# Altium project CSBox.PrjPcb
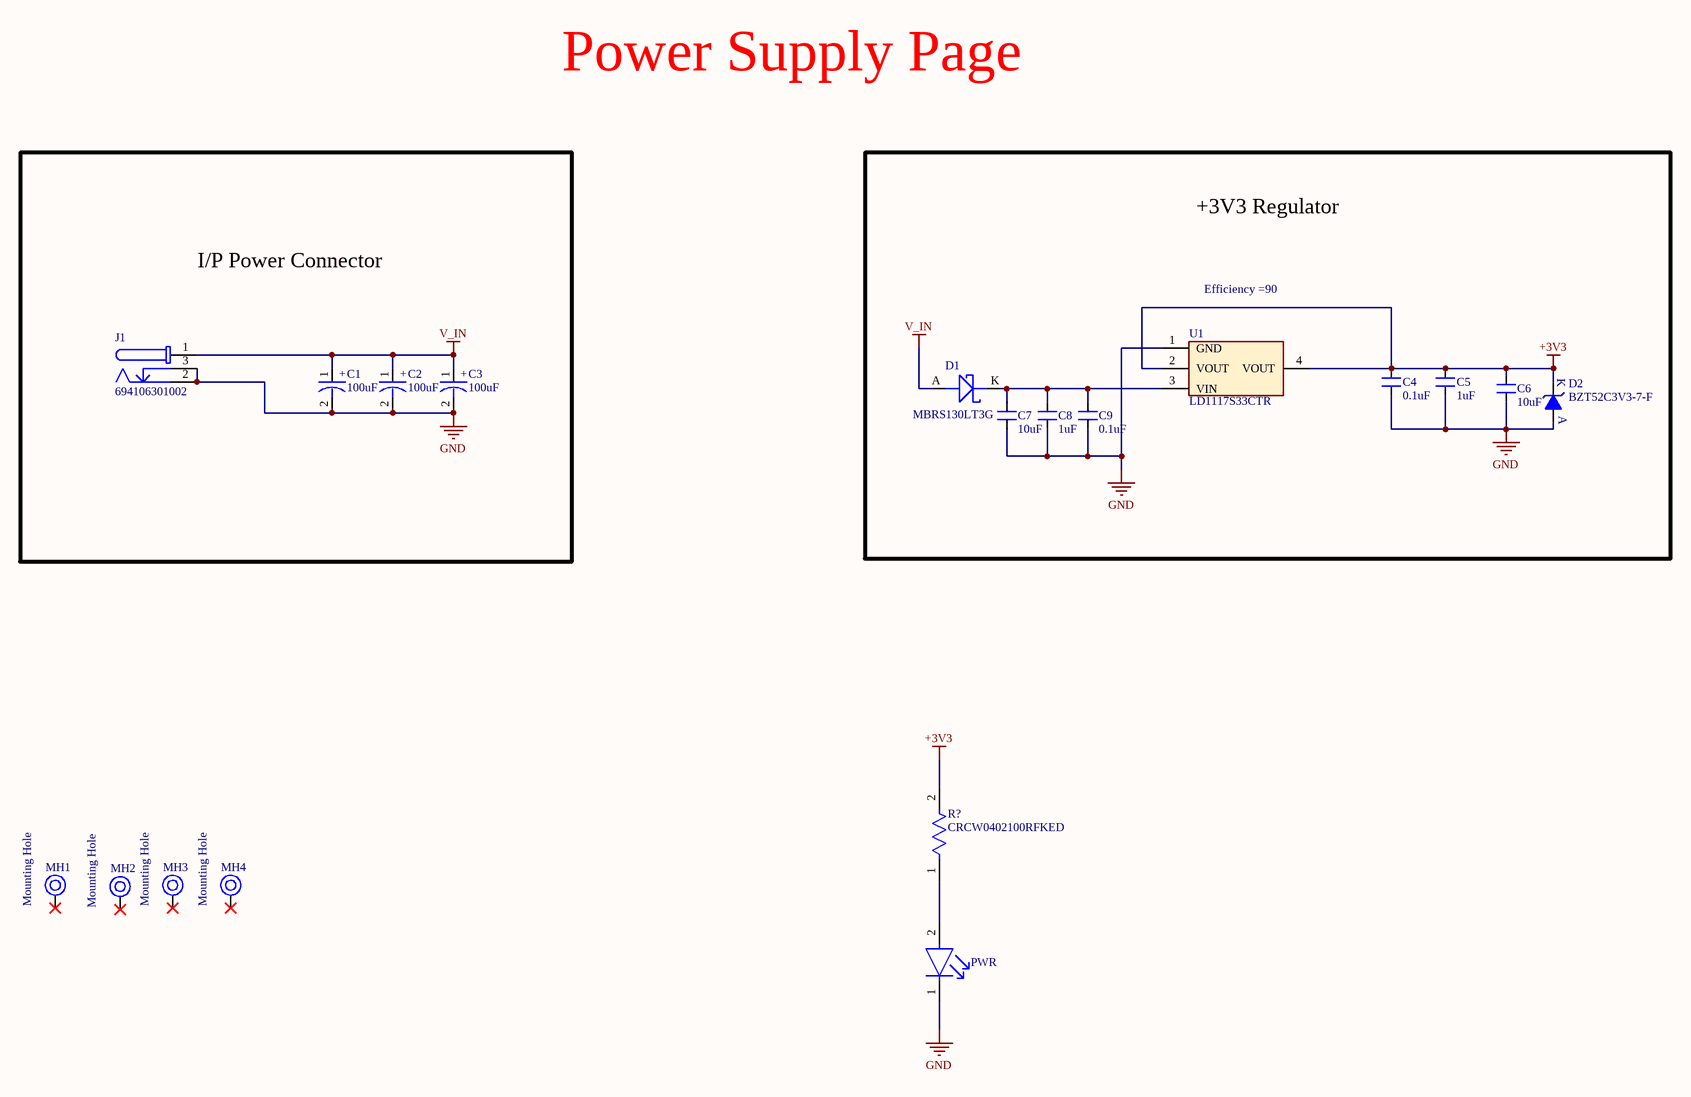
[diagram p0: power supply.SchDoc]
5 sheets, 95 parts. Net scope: global (net labels, ports and power ports of the same name join across sheets).
Board file: CSBox.PcbDoc
Sheets:
  power supply.SchDoc
  MCU.SchDoc
  Ethernet_1.SchDoc
  Ethernet_2.SchDoc
  Ethernet_3.SchDoc

## Sheet power supply.SchDoc: CSBOX
size A3; SheetNumber: 1; SheetTotal: 6

### Parts
C1  100uF  [ACAP_P305_D393_H393_RAD]
C2  100uF  [ACAP_P305_D393_H393_RAD]
C3  100uF  [ACAP_P305_D393_H393_RAD]
C4  0.1uF  [CAP_0805]
C5  1uF  [CAP_0805]
C6  10uF  [CAP_1206]
C7  10uF  [CAP_1206]
C8  1uF  [CAP_0805]
C9  0.1uF  [CAP_0805]
D1  MBRS130LT3G  [DIO_SMB_DO-214AA]
D2  BZT52C3V3-7-F  [DIO_SOD-123]
J1  694106301002  [694106301002]
MH1  Mounting Hole  [MOUNTING]
MH2  Mounting Hole  [MOUNTING]
MH3  Mounting Hole  [MOUNTING]
MH4  Mounting Hole  [MOUNTING]
PWR  APHHS1005CGCK  [FP-APHHS1005CGCK-MFG]  (value not drawn)
R?  CRCW0402100RFKED  [FP-CRCW0402-e3-IPC_C]
U1  LD1117S33CTR  [SOT223_3]

### Blocks framed on the sheet
I/P Power Connector: C1-C3 J1
+3V3 Regulator: C4-C9 D1 D2 U1

### Nets
+3V3: C4.2 C5.2 C6.2 D2.K R?.2 U1.2(VOUT) U1.4(VOUT)
GND: C1.2 C2.2 C3.2 C4.1 C5.1 C6.1 C7.1 C8.1 C9.1 D2.A J1.2 J1.3 PWR.1(C) U1.1(GND)
V_IN: C1.1 C2.1 C3.1 D1.A J1.1
NetC7_2: C7.2 C8.2 C9.2 D1.K U1.3(VIN)
NetPWR_2: PWR.2(A) R?.1

Not connected (* = marked no-connect by the designer): MH1 1*; MH2 1*; MH3 1*; MH4 1*

### Notes on the sheet
- Power Supply Page
- (near U1) Efficiency =90
- (in symbol CAP-P_100uF-50V-20%-RAD) +

### Library data of the parts
C1-C3 = CAP-P_100uF-50V-20%-RAD: 100µF 50V Aluminum Polymer Capacitor Radial, Can - SMD 28mOhm 4000 Hrs @ 125°C; Manufacturer: Nichicon; Manufacturer Part Number: GYA1H101MCQ1GS; Alternate Part Number-1: VEU101M1HTR-1010; Case/Package: Radial-SMD; Supplier-1: SP ROAD; Supplier Part Number-1: GYA1H101MCQ1GS
C4 C9 = CAP_0.1uF-50V-10%-0805: 0.1µF ±10% 50V Ceramic Capacitor X7R 0805 (2012 Metric); Manufacturer: Samsung; Manufacturer Part Number: CL21B104KBCNNNC; Alternate Part Number-1: NA; Case/Package: 0805; Supplier-1: SIRICOM; Supplier Part Number-1: 0805B104K500CT
C5 C8 = CAP_1uF-50V-5%-0805: 1µF ±5% 50V Ceramic Capacitor X7R 0805 (2012 Metric); Manufacturer: Samsung; Manufacturer Part Number: CC0805JKX7R9BB105; Alternate Part Number-1: 0805F105M500NT; Case/Package: 0805; Supplier-1: SIRICOM; Supplier Part Number-1: CL21B105KBFNNNE
C6 C7 = CAP_10uF-50V-10%-1206: 10µF ±10% 50V Ceramic Capacitor X7R 1206 (3216 Metric); Manufacturer: KEMET; Manufacturer Part Number: CL31B106KBHNNNE; Alternate Part Number-1: GRT31CR61H106ME01L; Case/Package: 1206; Supplier-1: SIRICOM; Supplier Part Number-1: CC1206KKX5R9BB106
D1 = DIO-S_445mV-30V-2A-SMB: Diode Schottky 30V 2A Surface Mount SMB; Manufacturer: ON Semiconductor; Alternate Part Number-1: NA; Manufacturer Part Number: MBRS130LT3G; Case/Package: SMB; Supplier-1: ARROW; Supplier Part Number-1: MBRS130LT3G
D2 = DIO-Z_3.3V-500mW-SOD123: Zener Diode 3.3V 500mW ±6% Surface Mount SOD-123; Manufacturer: Diodes Incorporated; Alternate Part Number-1: NA; Manufacturer Part Number: BZT52C3V3-7-F; Case/Package: SOD-123; Supplier-1: Digikey; Supplier Part Number-1: BZT52C3V3-FDICT-ND
J1 = CMP-1502-00188-2: NexarPartId: 52676100; Voltage Rating (DC): 20V; Gender: Male; Voltage Rating: 24V; Connector Type: Power; Insulation Resistance: 100MΩ; Current Rating: 5A; Shielding: Unshielded; Number of Contacts: 3; Color: Black; Housing Material: Polyamide; Contact Gender: Female; REACH SVHC: Unknown; Termination: Through Hole; Height: 11mm; RoHS: Compliant; Mount: Through Hole; Flammability Rating: UL94 V-0; Packaging: Bulk; Min Operating Temperature: -40°C; Contact Plating: Tin; Max Operating Temperature: 85°C; Operating Supply Voltage: 24V; Contact Material: Gold, Tin
MH1-MH4 = MH_3.5H_6D: Manufacturer Part Number: NA; Case/Package: TH; Manufacturer: NA; Supplier-1: NA; Supplier Part Number-1: NA; Alternate Part Number-1: NA
PWR = CMP-44529-000044-1: LED GREEN CLEAR CHIP SMD; Viewing Angle: 120°; Dominant Wavelength: 570nm; Test Current: 20mA; Luminous Intensity: 50mcd; Forward Voltage: 2.1V; Number of LEDs: 1; Lens Color: Clear; Packaging: Tape and Reel; Max Operating Temperature: 85°C; Illumination Color: Green; Length: 1mm; Mount: Surface Mount; Lens Style: Clear; Color: Green; Number of Pins: 2; Wavelength: 570nm; Case/Package: 0402; Width: 0.5mm; Package Quantity: 2000; Case Code (Metric): 1005; Height: 0.6mm; Lead Free: Lead Free; Case Code (Imperial): 0402; Forward Current: 20mA; Min Operating Temperature: -40°C
R? = CMP-1011-00397-3: RES Thick Film, 100Ω, 1%, 0.063W, 100ppm/°C, 0402; Max Power Dissipation: 63mW; Voltage Rating: 50V; Resistance: 100R; Package Quantity: 10; Lead Free: Lead Free; Termination: SMD/SMT; Case Code (Metric): 1005; Number of Terminations: 2; Composition: Thick Film; Voltage Rating (DC): 50V; Min Operating Temperature: -55°C; Case/Package: 0402; Radiation Hardening: No; Max Operating Temperature: 155°C; Temperature Coefficient: 100ppm/°C; Military Standard: Not; Length: 1mm; Mount: Surface Mount; Power Rating: 63mW; Weight: 2.3E-05oz; Working Voltage: 50V; Features: Automotive AEC-Q200; Depth: 0.5mm; Packaging: Tape and Reel; Tolerance: 1%; Height: 0.35mm; Case Code (Imperial): 0402; Width: 0.02inch; Contact Plating: Tin
U1 = REG_15V-3.3V-0.9A-12W-SOT223: Linear Voltage Regulator IC 1 Output 800mA SOT-223; Manufacturer: STMicroelectronics; Alternate Part Number-1: NA; Manufacturer Part Number: LD1117S33CTR; Case/Package: SOT223; Supplier-1: SP ROAD; Supplier Part Number-1: LD1117S33CTR

## Sheet MCU.SchDoc
size A3; SheetNumber: 2; SheetTotal: 6
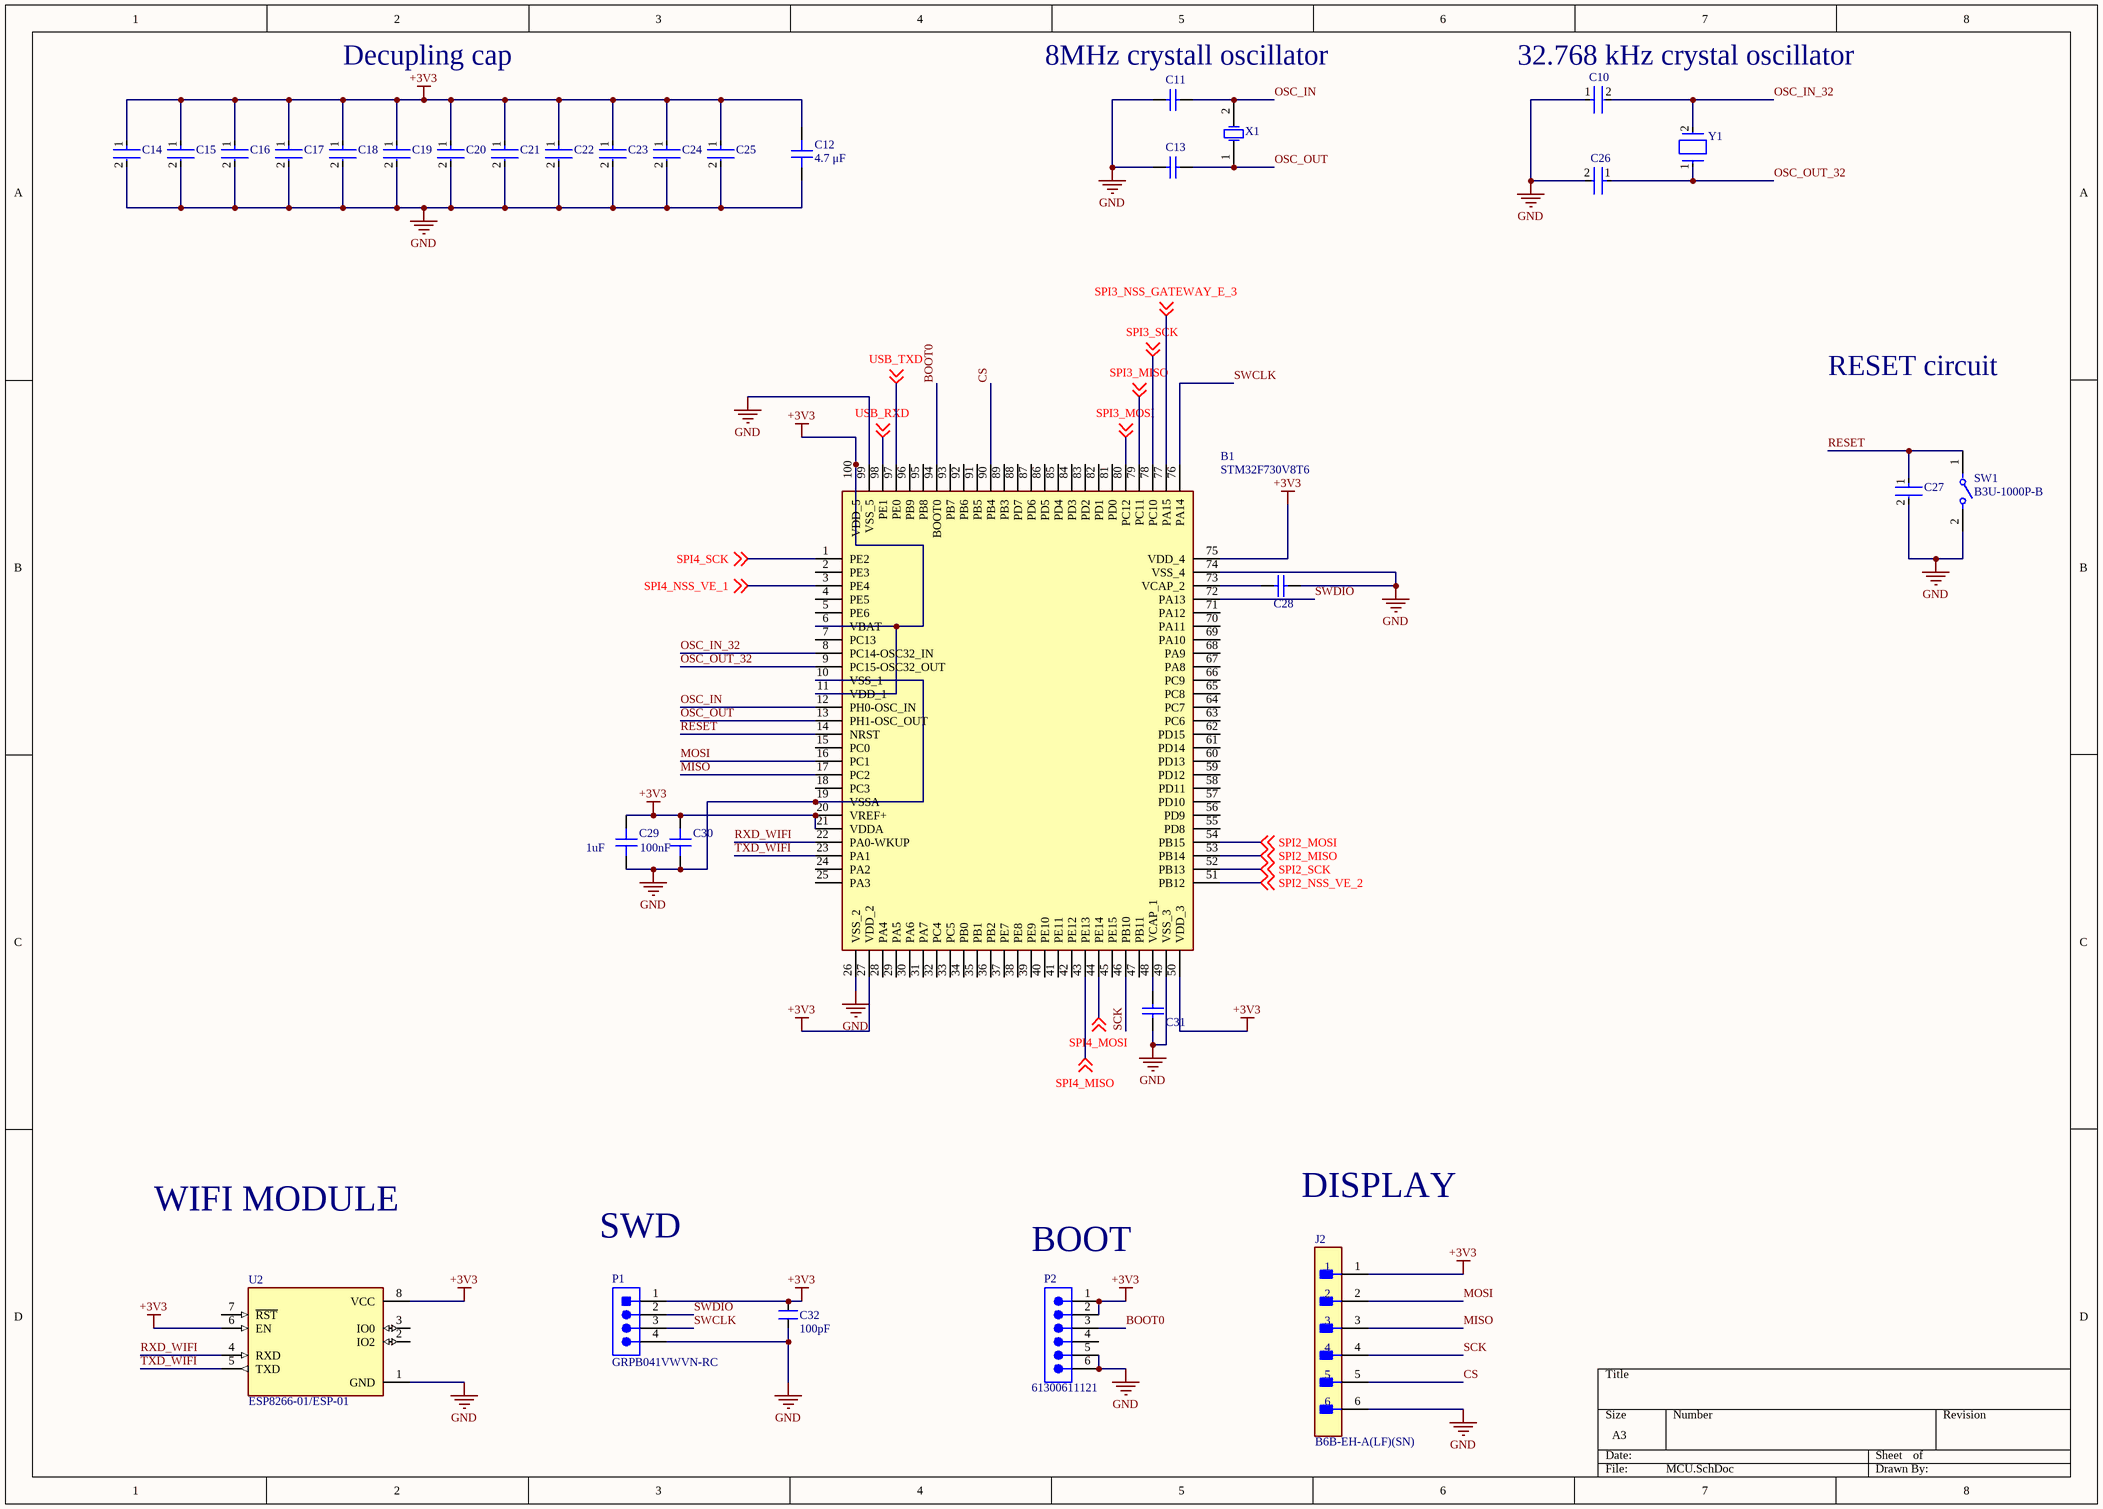
[diagram p1: MCU.SchDoc]

### Parts
B1  STM32F730V8T6  [QFP50P1600X1600X160-100N]
C10  C1005C0G1H070D050BA  [FP-C1005-050-0_05-IPC_A]  (value not drawn)
C11  CC0603JRNPO9BN180  [CAPC1608X90X40LL10T20]  (value not drawn)
C12  4.7 μF  [CAP 0402_1005]
C13  CC0603JRNPO9BN180  [CAPC1608X90X40LL10T20]  (value not drawn)
C14  GRM155R71H104KE14D  [FP-GRM155-0_05-IPC_B]  (value not drawn)
C15  GRM155R71H104KE14D  [FP-GRM155-0_05-IPC_B]  (value not drawn)
C16  GRM155R71H104KE14D  [FP-GRM155-0_05-IPC_B]  (value not drawn)
C17  GRM155R71H104KE14D  [FP-GRM155-0_05-IPC_B]  (value not drawn)
C18  GRM155R71H104KE14D  [FP-GRM155-0_05-IPC_B]  (value not drawn)
C19  GRM155R71H104KE14D  [FP-GRM155-0_05-IPC_B]  (value not drawn)
C20  GRM155R71H104KE14D  [FP-GRM155-0_05-IPC_B]  (value not drawn)
C21  GRM155R71H104KE14D  [FP-GRM155-0_05-IPC_B]  (value not drawn)
C22  GRM155R71H104KE14D  [FP-GRM155-0_05-IPC_B]  (value not drawn)
C23  GRM155R71H104KE14D  [FP-GRM155-0_05-IPC_B]  (value not drawn)
C24  GRM155R71H104KE14D  [FP-GRM155-0_05-IPC_B]  (value not drawn)
C25  GRM155R71H104KE14D  [FP-GRM155-0_05-IPC_B]  (value not drawn)
C26  C1005C0G1H070D050BA  [FP-C1005-050-0_05-IPC_A]  (value not drawn)
C27  GRM155R71H104KE14D  [FP-GRM155-0_05-IPC_B]  (value not drawn)
C28  C0603C225K9PACTU  [CAPC1608X90X35LL15T15]  (value not drawn)
C29  1uF  [CAP 0402_1005]
C30  100nF  [CAP 0402_1005]
C31  C0603C225K9PACTU  [CAPC1608X90X35LL15T15]  (value not drawn)
C32  100pF  [CAP_0805]
J2  B6B-EH-A(LF)(SN)  [FP-B6B-EH-A_LF_SN-MFG]
P1  GRPB041VWVN-RC  [SLIN-GRPB041VWVN-RC_V]
P2  61300611121  [61300611121]
SW1  B3U-1000P-B  [FP-B3U-1000P-B-MFG]
U2  ESP8266-01/ESP-01  [XCVR_ESP8266-01/ESP-01]
X1  ECS-80-18-5PX-TR  [ECS-80-18-5PX-TR_V]  (value not drawn)
Y1  ABS07-32.768KHZ-7-T  [FP-ABS07-MFG]  (value not drawn)

### Nets
+3V3: B1.6(VBAT) B1.11(VDD_1) B1.20(VREF+) B1.21(VDDA) B1.27(VDD_2) B1.50(VDD_3) B1.75(VDD_4) B1.100(VDD_5) C12.2 C14.1 C15.1 C16.1 C17.1 C18.1 C19.1 C20.1 C21.1 C22.1 C23.1 C24.1 C25.1 C29.2 C30.2 C32.2 J2.1 P1.1 P2.1 P2.2 U2.6(EN) U2.8(VCC)
GND: B1.10(VSS_1) B1.19(VSSA) B1.26(VSS_2) B1.49(VSS_3) B1.74(VSS_4) B1.99(VSS_5) C10.1 C11.2 C12.1 C13.2 C14.2 C15.2 C16.2 C17.2 C18.2 C19.2 C20.2 C21.2 C22.2 C23.2 C24.2 C25.2 C26.2 C27.2 C28.1 C29.1 C30.1 C31.1 C32.1 J2.6 P1.4 P2.5 P2.6 SW1.2 U2.1(GND)
BOOT0: B1.94(BOOT0) P2.3
CS: B1.90(PB4) J2.5
MISO: B1.17(PC2) J2.3
MOSI: B1.16(PC1) J2.2
OSC_IN: B1.12(PH0-OSC_IN) C11.1 X1.2(X2)
OSC_IN_32: B1.8(PC14-OSC32_IN) C10.2 Y1.2
OSC_OUT: B1.13(PH1-OSC_OUT) C13.1 X1.1(X1)
OSC_OUT_32: B1.9(PC15-OSC32_OUT) C26.1 Y1.1
RESET: B1.14(NRST) C27.1 SW1.1
RXD_WIFI: B1.22(PA0-WKUP) U2.4(RXD)
SCK: B1.46(PB10) J2.4
SPI2_MISO: B1.53(PB14) ; off-sheet SPI2_MISO
SPI2_MOSI: B1.54(PB15) ; off-sheet SPI2_MOSI
SPI2_NSS_VE_2: B1.51(PB12) ; off-sheet SPI2_NSS_VE_2
SPI2_SCK: B1.52(PB13) ; off-sheet SPI2_SCK
SPI3_MISO: B1.79(PC11) ; off-sheet SPI3_MISO
SPI3_MOSI: B1.80(PC12) ; off-sheet SPI3_MOSI
SPI3_NSS_GATEWAY_E_3: B1.77(PA15) ; off-sheet SPI3_NSS_GATEWAY_E_3
SPI3_SCK: B1.78(PC10) ; off-sheet SPI3_SCK
SPI4_MISO: B1.43(PE13) ; off-sheet SPI4_MISO
SPI4_MOSI: B1.44(PE14) ; off-sheet SPI4_MOSI
SPI4_NSS_VE_1: B1.3(PE4) ; off-sheet SPI4_NSS_VE_1
SPI4_SCK: B1.1(PE2) ; off-sheet SPI4_SCK
SWCLK: B1.76(PA14) P1.3
SWDIO: B1.72(PA13) P1.2
TXD_WIFI: B1.23(PA1) U2.5(TXD)
USB_RXD: B1.98(PE1) ; off-sheet USB_RXD
USB_TXD: B1.97(PE0) ; off-sheet USB_TXD
NetB1_48: B1.48(VCAP_1) C31.2
NetB1_73: B1.73(VCAP_2) C28.2

Not connected (* = marked no-connect by the designer): B1 2(PE3) 4(PE5) 5(PE6) 7(PC13) 15(PC0) 18(PC3) 24(PA2) 25(PA3) 28(PA4) 29(PA5) 30(PA6) 31(PA7) 32(PC4) 33(PC5) 34(PB0) 35(PB1) 36(PB2) 37(PE7) 38(PE8) 39(PE9) 40(PE10) 41(PE11) 42(PE12) 45(PE15) 47(PB11) 55(PD8) 56(PD9) 57(PD10) 58(PD11) 59(PD12) 60(PD13) 61(PD14) 62(PD15) 63(PC6) 64(PC7) 65(PC8) 66(PC9) 67(PA8) 68(PA9) 69(PA10) 70(PA11) 71(PA12) 81(PD0) 82(PD1) 83(PD2) 84(PD3) 85(PD4) 86(PD5) 87(PD6) 88(PD7) 89(PB3) 91(PB5) 92(PB6) 93(PB7) 95(PB8) 96(PB9); P2 4; U2 2(IO2) 3(IO0) 7(~{RST})

### Notes on the sheet
- Decupling cap
- (near C11) 8MHz crystall oscillator
- (near C10) 32.768 kHz crystal oscillator
- RESET circuit
- WIFI MODULE
- SWD
- (near P2) BOOT
- DISPLAY

### Library data of the parts
B1 = STM32F730V8T6: STMICROELECTRONICS - STM32F730V8T6 - MCU, 32BIT, 216MHZ, LQFP-100; Geometry.Height: 1.6mm; Manufacturer_Name: STMicroelectronics; Manufacturer_Part_Number: STM32F730V8T6; Mouser Part Number: 511-STM32F730V8T6; Mouser Price/Stock: https://www.mouser.co.uk/ProductDetail/STMicroelectronics/STM32F730V8T6?qs=%252BEew9%252B0nqrCl2wqvNLr5sw%3D%3D; Arrow Part Number: STM32F730V8T6; Arrow Price/Stock: https://www.arrow.com/en/products/stm32f730v8t6/stmicroelectronics; Datasheet Link: https://www.st.com/resource/en/datasheet/stm32f730v8.pdf
C10 C26 = CMP-08246-005328-1: Multilayer Ceramic Capacitors 7pF ±0.5pF 50V C0G SMD 0402; Voltage Rating: 50V; Max Operating Temperature: 125°C; Case/Package: 0402; Case Code (Imperial): 0402; Dielectric: C0G; Min Operating Temperature: -55°C; REACH SVHC: No SVHC; Depth: 0.5mm; RoHS Compliant: Yes; Packaging: Cut Tape; Weight: 2.3E-05oz; Capacitance: 7pF; Package Quantity: 1; Case Code (Metric): 1005; Termination: SMD/SMT; Thickness: 0.022inch; Series: C; Length: 1mm; Voltage Rating (DC): 50V; Width: 0.02inch; Construction: Flat; Lead Free: Lead Free; Mount: Surface Mount; Radiation Hardening: No; Dielectric Material: Ceramic; Height: 0.5mm; Number of Pins: 2
C11 C13 = CMP-1659-00030-1: Chip Capacitor, 18 pF, +/- 5%, 50 V, -55 to 125 degC, 0603 (1608 Metric), RoHS, Tape and Reel; Voltage Rating: 50 V; Case\Package: 0603; Power Rating: 100 mW; Resistance: 68.1 Ohm; Tolerance: 1%; Case Code (Metric): 1608; Max Operating Temperature: 155 degC; RoHSCompliant: true; Case Code (Imperial): 0603; ComponentLink2Description: Datasheet; Package Quantity: 200; PackageReference: 0603; ComponentLink2URL: http://www.yageo.com/NewPortal/yageodocoutput?fileName=/pdf/MLCC/UPY-GP_NP0_16V-to-50V_14.pdf; Length: 1.6 mm; DatasheetVersion: Rev. 14, 07/2016; Min Operating Temperature: -55 degC; ComponentLink1URL: http://www.yageo.com/; Width: 0.8 mm; ComponentLink1Description: Manufacturer URL; Height: 0.45 mm; Radiation Hardening: No; PackageDescription: 2-Pin Surface Mount Device, Body 1.6 x 0.8 mm; Packaging: Tape and Reel
C12 C29 = Cap 0402: SMT Capacitor; VALUE: 100nF
C14-C25 C27 = CMP-2008-04639-2: Chip Multilayer Ceramic Capacitors for General Purpose, 0402, 0.10uF, X7R, 15%, 10%, 50V; Dissipation Factor: 0.025%; Capacitance: 100nF; Weight: 0.000212oz; Thickness: 0.022inch; Voltage Rating (DC): 50V; Dielectric Material: Ceramic; Termination: SMD/SMT; Case/Package: 0402; Case Code (Imperial): 0402; Mount: Surface Mount; REACH SVHC: No SVHC; Resistor Type: Ceramic; Dielectric: X7R; Max Operating Temperature: 125°C; Voltage: 50V; Lead Free: Lead Free; Package Quantity: 10000; Packaging: Tape and Reel; Length: 1mm; Material: Ceramic; Height: 0.5mm; Depth: 0.5mm; Width: 0.5mm; Min Operating Temperature: -55°C; Tolerance: 10%; Case Code (Metric): 1005; Voltage Rating: 50V
C28 C31 = CMP-2006-02260-1: Manufacturer: Kemet; Part Number: C0603C225K9PACTU
C30 = Cap 0402: SMT Capacitor; VALUE: 100nF
C32 = CAP_100pF-100V-5%-0805: 100pF ±5% 100V Ceramic Capacitor C0G, NP0 0805 (2012 Metric); Manufacturer: Murata; Manufacturer Part Number: CL21C101JC61PNC; Alternate Part Number-1: NA; Case/Package: 0805; Supplier-1: SIRICOM; Supplier Part Number-1: 0805N101J101CT
J2 = CMP-17439-000293-1: CONN HEADER VERT 6POS 2.5MM; Voltage Rating: 250V; Number of Positions: 6; Current Rating: 3A; Mated Stacking Heights: 8.1mm; Gender: Male; Insulation Material: Nylon; Number of Contacts: 6; Contact Plating: Tin; Pitch: 2.5mm; Orientation: Straight; Insulation Color: Natural; Packaging: Bulk; Termination: Solder; Flammability Rating: UL94 V-0; Lead Free: Lead Free; Contact Mating Length: 0.13inch; Color: Natural; Contact Finish - Mating: TIN; Connector Type: Header; Contact Shape: Square; Contact Type: Male Pin; Series: EH; Contact Material: Brass; Fastening Type: Friction; Number of Rows: 1; Mount: Through Hole; Housing Color: White
P1 = CMP-2000-06373-1: Male Header, Pitch 1.27 mm, 1 x 4 Position, Height 4 mm, Tail Length 2.3 mm, -40 to 105 degC, RoHS, Bulk; Manufacturer: Sullins; Mating Products: S9010E-04-ND / -CONNHEADER.050"4POSR/APCB / S9008E-04-ND / -CONNHEADER.050"4POSPCBGOLD / S9005E-04-ND / -CONNHEADER.050"4POSSMDGOLD; Other Names: S9014E-04; Dynamic Catalog: GRPB; Pitch: 0.050"(1.27mm); Number of Positions Loaded: All; Number of Positions: 4; Catalog Drawings: S9014ESeriesTop; Connector Type: Header,Unshrouded; Contact Finish Thickness: Flash; Number of Rows: 1; Contact Type: MalePin; Category: Connectors,Interconnects; Contact Mating Length: 0.118"(3.00mm); Family: RectangularConnectors-Headers,MalePins; Datasheet Version: Rev. C, 12/2008; Contact Finish: Gold; Termination: Solder; Manufacturer URL: http://www.sullinscorp.com/; Mounting Type: ThroughHole; Packaging: Bulk; Package Reference: GRPB041VWVN-RC; Datasheet URL: http://www.sullinscorp.com/drawings/71_GRPB___1VWVN-RC,_10957-C.pdf; Mounting Technology: ThroughHole; Package Description: Male Header, Pitch 1.27 mm, 1 x 4 Position, Height 4 mm, Tail Length 2.3 mm; Standard Package: 1
P2 = CMP-1502-01070-2: NexarPartId: 20084590; Operating Supply Voltage: 250V; Current Rating: 3A; Number of Contacts: 6; Gender: Male; Connector Type: Male Pin; Pitch: 2.54mm; Contact Resistance: 20mΩ; Lead Free: Lead Free; REACH SVHC: Unknown; Number of Rows: 1; Color: Black; Min Operating Temperature: -40°C; Contact Material: Copper; Lead Pitch: 2.54mm; Contact Plating: Gold; Number of Pins: 6; Height: 8.89mm; Orientation: Vertical; Termination: Through Hole; Mount: Through Hole; RoHS: Compliant; Contact Gender: Male; Contact Mating Length: 5.9944mm; Voltage Rating: 250V; Number of Positions: 6; Housing Material: PBT; Packaging: Bulk; Max Operating Temperature: 105°C
SW1 = CMP-08834-000005-1: SWITCH TACTILE SPST-NO 0.05A 12V; Manufacturer: Omron; Operating Force: 1.5N; Contact Current Rating: 50mA; Contact Resistance: 100mΩ; Electromechanical Life: 200000Cycles; Height: 1.75mm; Device Class L2: Switches; Temperature Range High: +70°C; Digikey Description: SWITCH TACTILE SPST-NO 0.05A 12V; Throw Configuration: SPST-NO; Ambient Temperature Range High: +70°C; Temperature: -25°C to +70°C; Lead Free: Yes; ComponentLink2URL: https://omronfs.omron.com/en_US/ecb/products/pdf/en-b3u.pdf; Device Class L3: Tactile Switches; Manufacturer Part Number: B3U-1000P-B; Ambient Temperature Range Low: -25°C; Mount: Surface Mount; Automotive: No; Mouser Description: Tactile Switches Top Actuated with boss w/o ground; Octopart: https://octopart.com/b3u-1000p-b-omron-1057356; RoHS: TRUE; Package: 0; Device Class L1: Electromechanical; Voltage Rating Dc: 12V; Category: Switch; Temperature Range Low: -25°C; ComponentLink2Description: Datasheet
U2 = ESP8266-01/ESP-01: MakerFocus 4pcs ESP8266 ESP-01 Serial Wireless WiFi Transceiver Receiver Module 1MB SPI Flash DC3.0-3.6V Internet of Things WiFi Module Board Compatible with Ar duino; Value: *; MP: ESP8266-01/ESP-01; Package: None; Availability: Unavailable; Price: None
X1 = CMP-2000-06193-1: Low Profile Quartz Crystal, 8.0 MHz, 2-Pin SMD, RoHS, Tape and Reel; Brand: ECS; Tolerance: 30PPM; Case Height: 4.3mm; Frequency: 8MHz; Frequency Stability: 50PPM; Case Length: 13.2mm; Case Width: 4.8mm; Load Capacitance: 18pF; Termination Style: SMD/SMT; Product Category: Crystals; Packaging: Reel; Package Reference: ECS-80-18-5PX-TR; Mounting Technology: SurfaceMount; Dimensions: 4.8mmWx13.2mmLx4.3mmH; Package Description: 2-Pin Surface Mount Device, Body 11.4 x 4.8 mm, Height 4.3 mm; Datasheet URL: https://www.ecsxtal.com/store/pdf/csm-7x.pdf; Datasheet Version: 05/2016; Manufacturer: ECS; Factory Pack Quantity: 1000; Manufacturer URL: https://www.ecsxtal.com/; Type: SMDQuartzCrystals; Mounting Style: SMD/SMT; Package / Case: HC-49/US; Operating Temperature Range: -10Cto+70C; RoHS: Details; Series: CSM-7X
Y1 = CMP-27762-014373-1: Crystal 32.768kHz ±20ppm (Tol) 7pF FUND 70kΩ 2-Pin CSMD T/R; Insulation Resistance: 500MR; Series Resistance: 70kR; Mount: Surface Mount; Tolerance: 20ppm; Length: 3.2mm; Lead Free: Lead Free; Frequency: 32.768kHz; Frequency Tolerance: 20ppm; Frequency Stability: 20ppm; Load Capacitance: 7pF; Radiation Hardening: No; Package Quantity: 3000; Width: 1.5mm; Height: 0.9mm; Termination: SMD/SMT; Max Operating Temperature: 85°C; Number of Pins: 2; Operating Frequency: 32.768 kHz; ESR (Equivalent Series Resistance): 70kR; Packaging: Tape and Reel; Series: ABS07; Min Operating Temperature: -40°C; Depth: 1.5mm; Case/Package: CSMD

## Sheet Ethernet_1.SchDoc
size A3; SheetNumber: 4; SheetTotal: 6
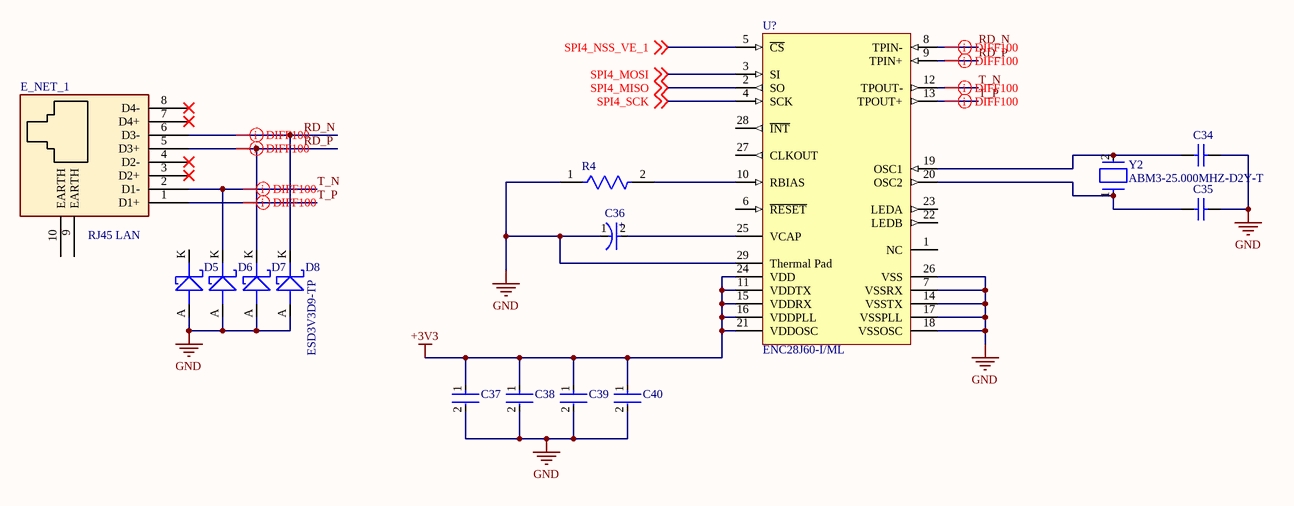
[diagram p2: Ethernet_1.SchDoc]

### Parts
C34  CC0603JRNPO9BN180  [CAPC1608X90X40LL10T20]  (value not drawn)
C35  CC0603JRNPO9BN180  [CAPC1608X90X40LL10T20]  (value not drawn)
C36  593D106X9016A2TE3  [FP-593DA-MFG]  (value not drawn)
C37  C0402C104K8RACTU  [FP-C0402-BB-MFG]  (value not drawn)
C38  C0402C104K8RACTU  [FP-C0402-BB-MFG]  (value not drawn)
C39  C0402C104K8RACTU  [FP-C0402-BB-MFG]  (value not drawn)
C40  C0402C104K8RACTU  [FP-C0402-BB-MFG]  (value not drawn)
D5  ESD3V3D9-TP  [DIO_SOD-923]  (value not drawn)
D6  ESD3V3D9-TP  [DIO_SOD-923]  (value not drawn)
D7  ESD3V3D9-TP  [DIO_SOD-923]
D8  ESD3V3D9-TP  [DIO_SOD-923]  (value not drawn)
E_NET_1  RJ45 LAN  [CON10_P106_RJ45_TH_ST]
R4  ERJ-2RKF2001X  [FP-ERJ2RK-MFG]  (value not drawn)
U?  ENC28J60-I/ML  [QFN-ML28_M]
Y2  ABM3-25.000MHZ-D2Y-T  [FP-ABM3-MFG]

### Nets
+3V3: C37.1 C38.1 C39.1 C40.1 U?.11(VDDTX) U?.15(VDDRX) U?.16(VDDPLL) U?.21(VDDOSC) U?.24(VDD)
GND: C34.1 C35.1 C36.1(C) C37.2 C38.2 C39.2 C40.2 D5.A D6.A D7.A D8.A R4.1 U?.7(VSSRX) U?.14(VSSTX) U?.17(VSSPLL) U?.18(VSSOSC) U?.26(VSS) U?.29(Thermal_Pad)
RD_N: D8.K E_NET_1.6(D3-) U?.8(TPIN-)
RD_P: D7.K E_NET_1.5(D3+) U?.9(TPIN+)
SPI4_MISO: U?.2(SO) ; off-sheet SPI4_MISO
SPI4_MOSI: U?.3(SI) ; off-sheet SPI4_MOSI
SPI4_NSS_VE_1: U?.5(~{CS}) ; off-sheet SPI4_NSS_VE_1
SPI4_SCK: U?.4(SCK) ; off-sheet SPI4_SCK
T_N: D6.K E_NET_1.2(D1-) U?.12(TPOUT-)
T_P: E_NET_1.1(D1+) U?.13(TPOUT+)
NetC34_2: C34.2 U?.19(OSC1) Y2.2
NetC35_2: C35.2 U?.20(OSC2) Y2.1
NetC36_2: C36.2(A) U?.25(VCAP)
NetR4_2: R4.2 U?.10(RBIAS)

Not connected (* = marked no-connect by the designer): D5 K; E_NET_1 3(D2+)* 4(D2-)* 7(D4+)* 8(D4-)* 9(EARTH) 10(EARTH); U? 1(NC) 6(~{RESET}) 22(LEDB) 23(LEDA) 27(CLKOUT) 28(~{INT})

### Layout directives
differential pair; differential pair class DIFF100; rule Differential Pairs Routing [Pref Gap = 8mil    Min Gap  = 8mil    Max Gap  = 8milPref Width = 10mil    Min Width  = 10mil    Max Width  = 10mil]: RD_N, RD_P, T_N, T_P

### Notes on the sheet
- (in symbol CMP-00030-39455466-1) +

### Library data of the parts
C34 C35 = CMP-1659-00030-1: as C11 on sheet MCU; Case Code (Metric): 1608; Max Operating Temperature: 155 degC; RoHSCompliant: true; Case Code (Imperial): 0603; ComponentLink2Description: Datasheet; Package Quantity: 200; PackageReference: 0603; ComponentLink2URL: http://www.yageo.com/NewPortal/yageodocoutput?fileName=/pdf/MLCC/UPY-GP_NP0_16V-to-50V_14.pdf; Length: 1.6 mm; DatasheetVersion: Rev. 14, 07/2016; Min Operating Temperature: -55 degC; ComponentLink1URL: http://www.yageo.com/; Width: 0.8 mm; ComponentLink1Description: Manufacturer URL; Height: 0.45 mm; Radiation Hardening: No; PackageDescription: 2-Pin Surface Mount Device, Body 1.6 x 0.8 mm; Packaging: Tape and Reel
C36 = CMP-00030-39455466-1: 593D106X9016A2TE3 Cap Tant Solid 10uF 16V A CASE 10% (3.2 X 1.6 X 1.6mm) SMD 3216-18 1.7 Ohm 125C T/R; ESR (Equivalent Series Resistance): 1.7Ω; Polarity: Polar; Dissipation Factor: 6%; Ripple Current: 210µA; Capacitance: 10µF; Leakage Current: 1.6µA; Tolerance: 10%; Max Operating Temperature: 125°C; Voltage: 16V; Width: 1.6mm; Schedule B: 8532210050, 8532210050; Voltage Rating: 16V; NexarPartId: 39455466; REACH SVHC: Unknown; Length: 3.2mm; RoHS: Compliant; Case/Package: 1206; Height: 1.6mm; Termination: SMD/SMT; Depth: 1.6mm; Lead Free: Lead Free; Case Code (Imperial): 1206; Packaging: Cut Tape; Case Code (Metric): 3216; Voltage Rating (DC): 16V; Height - Seated (Max): 1.8034mm; Radiation Hardening: No; Features: General Purpose; Mount: PCB, Surface Mount; Min Operating Temperature: -55°C
C37-C40 = CMP-2008-03086-2: CAP CER 0.1UF 10V X7R 0402; Manufacturer: Kemet; Capacitance: 0.10 μF; Tolerance: 0.1; Temperature Coefficient: 15%; Value: 0.10 μF; Material: Ceramic; Automotive: No; Temperature Range High: +125°C; Octopart: https://octopart.com/c0402c104k8ractu-kemet-106349; ComponentLink2Description: Datasheet; ComponentLink2URL: https://content.kemet.com/datasheets/KEM_C1002_X7R_SMD.pdf; Temperature: -55°C to +125°C; RoHS: TRUE; Temperature Range Low: -55°C; Temperature Characteristic: X7R; Lead Free: Yes; Height: 0.55mm; Manufacturer Part Number: C0402C104K8RACTU; Voltage Rating: 10 V; Category: Cap; Device Class L3: Ceramic Capacitors; Digikey Description: CAP CER 0.1UF 10V X7R 0402; Package: C0402-BB; Device Class L1: Passive Components; Ipc Land Pattern Name: CAPC10050X50; Mouser Description: Multilayer Ceramic Capacitors MLCC - SMD/SMT 10volts 0.1uF X7R 10%; Device Class L2: Capacitors
D5-D8 = DIO-T_3.3V-8.8V-SOD923: 8.8V Clamp 5A (8/20µs) Ipp Tvs Diode Surface Mount SOD-923; Manufacturer: Micro Commercial Co; Alternate Part Number-1: NA; Manufacturer Part Number: ESD3V3D9-TP; Case/Package: SOD923; Supplier-1: Digikey; Supplier Part Number-1: ESD3V3D9-TPMSCT-ND - Cut Tape (CT)
E_NET_1 = CON-SKT-RJ_8C8P-RA-TH: 8 Pins, 2 Row 2.54mm Pitch, right angle Connector, male; Manufacturer: Assmann; Manufacturer Part Number: A-2004-2-4-LPS-N-R; Alternate Part Number-1: NA; Case/Package: TH-CON; Supplier-1: SP ROAD; Supplier Part Number-1: A-2004-2-4-LPS-N-R
R4 = CMP-2002-00758-4: RES SMD 2K OHM 1% 1/10W 0402; Temperature Coefficient: 100ppm/°C; Max Power Dissipation: 100mW; Working Voltage: 50V; Resistance: 2kR; Number of Terminations: 2; Technology: THICK FILM; Packaging: Tape and Reel; RoHS Compliant: Yes; Min Operating Temperature: -55°C; Length: 1mm; Construction: Rectangular; Features: Automotive AEC-Q200; Contact Plating: Tin; Lead Free: Lead Free; Series: ERJ; Power Rating: 100mW; REACH SVHC: No SVHC; Resistor Type: Thick Film; Max Operating Temperature: 155°C; Package Quantity: 10000; Height: 0.35mm; Case/Package: 0402; Tolerance: 1%; Mount: Surface Mount; Termination: SMD/SMT; Resistance Tolerance: 1%; Depth: 0.5mm; Voltage Rating (DC): 50V; Voltage Rating: 50V; Case Code (Imperial): 0402; Military Standard: Not; Width: 0.02inch; Radiation Hardening: No; Case Code (Metric): 1005
U? = CMP-0186-00028-2: Stand-Alone Ethernet Controller with SPI Interface, 28-Pin QFN, Industrial Temperature; ComponentLink1URL: http://www.microchip.com/; ComponentLink2Description: Datasheet; DatasheetVersion: revC, Jan-2008; ComponentLink1Description: Manufacturer URL; PackageReference: QFN-ML28; ComponentLink3Description: Package Specification; PackageVersion: revBB, Aug-2009; ComponentLink2URL: http://ww1.microchip.com/downloads/en/DeviceDoc/39662c.pdf; ComponentLink3URL: http://www.microchip.com/stellent/groups/techpub_sg/documents/packagingspec/en012702.pdf; RevisionNote: URLs added.; Code_JEDEC: MO-220; PackageDescription: 28-Lead Plastic Quad Flat, No Lead Package (ML) - 6x6 mm Body [QFN] with 0.55 mm Contact Length
Y2 = CMP-27762-002203-1: Crystal 25MHz ±20ppm 18pF SMD-2 5mm x 3.2mm; Series Resistance: 30R; Frequency Stability: 30ppm; Load Capacitance: 18pF; Length: 5mm; Operating Frequency: 25 MHz; Number of Pins: 2; Depth: 3.2mm; Case/Package: CSMD; Packaging: Tape and Reel; Min Operating Temperature: -40°C; Width: 3.2mm; Termination: SMD/SMT; Lead Free: Lead Free; Frequency: 25MHz; Frequency Tolerance: 20ppm; ESR (Equivalent Series Resistance): 30R; Package Quantity: 1000; Max Operating Temperature: 85°C; Height: 0.051inch; Series: ABM3; REACH SVHC: Yes; Mount: Surface Mount; Resistor Type: Ceramic; Tolerance: 20ppm

## Sheet Ethernet_2.SchDoc
size A3; SheetNumber: 5; SheetTotal: 6
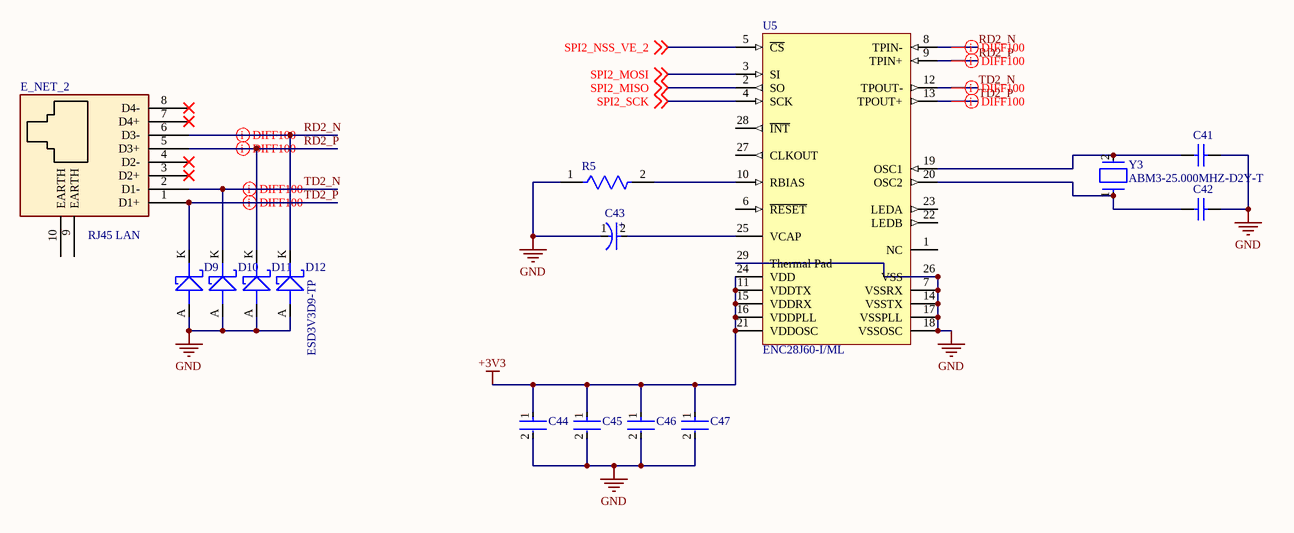
[diagram p3: Ethernet_2.SchDoc]

### Parts
C41  CC0603JRNPO9BN180  [CAPC1608X90X40LL10T20]  (value not drawn)
C42  CC0603JRNPO9BN180  [CAPC1608X90X40LL10T20]  (value not drawn)
C43  593D106X9016A2TE3  [FP-593DA-MFG]  (value not drawn)
C44  C0402C104K8RACTU  [FP-C0402-BB-MFG]  (value not drawn)
C45  C0402C104K8RACTU  [FP-C0402-BB-MFG]  (value not drawn)
C46  C0402C104K8RACTU  [FP-C0402-BB-MFG]  (value not drawn)
C47  C0402C104K8RACTU  [FP-C0402-BB-MFG]  (value not drawn)
D9  ESD3V3D9-TP  [DIO_SOD-923]  (value not drawn)
D10  ESD3V3D9-TP  [DIO_SOD-923]  (value not drawn)
D11  ESD3V3D9-TP  [DIO_SOD-923]
D12  ESD3V3D9-TP  [DIO_SOD-923]  (value not drawn)
E_NET_2  RJ45 LAN  [CON10_P106_RJ45_TH_ST]
R5  ERJ-2RKF2001X  [FP-ERJ2RK-MFG]  (value not drawn)
U5  ENC28J60-I/ML  [QFN-ML28_M]
Y3  ABM3-25.000MHZ-D2Y-T  [FP-ABM3-MFG]

### Nets
+3V3: C44.1 C45.1 C46.1 C47.1 U5.11(VDDTX) U5.15(VDDRX) U5.16(VDDPLL) U5.21(VDDOSC) U5.24(VDD)
GND: C41.1 C42.1 C43.1(C) C44.2 C45.2 C46.2 C47.2 D9.A D10.A D11.A D12.A R5.1 U5.7(VSSRX) U5.14(VSSTX) U5.17(VSSPLL) U5.18(VSSOSC) U5.26(VSS) U5.29(Thermal_Pad)
RD2_N: D12.K E_NET_2.6(D3-) U5.8(TPIN-)
RD2_P: D11.K E_NET_2.5(D3+) U5.9(TPIN+)
SPI2_MISO: U5.2(SO) ; off-sheet SPI2_MISO
SPI2_MOSI: U5.3(SI) ; off-sheet SPI2_MOSI
SPI2_NSS_VE_2: U5.5(~{CS}) ; off-sheet SPI2_NSS_VE_2
SPI2_SCK: U5.4(SCK) ; off-sheet SPI2_SCK
TD2_N: D10.K E_NET_2.2(D1-) U5.12(TPOUT-)
TD2_P: D9.K E_NET_2.1(D1+) U5.13(TPOUT+)
NetC41_2: C41.2 U5.19(OSC1) Y3.2
NetC42_2: C42.2 U5.20(OSC2) Y3.1
NetC43_2: C43.2(A) U5.25(VCAP)
NetR5_2: R5.2 U5.10(RBIAS)

Not connected (* = marked no-connect by the designer): E_NET_2 3(D2+)* 4(D2-)* 7(D4+)* 8(D4-)* 9(EARTH) 10(EARTH); U5 1(NC) 6(~{RESET}) 22(LEDB) 23(LEDA) 27(CLKOUT) 28(~{INT})

### Layout directives
differential pair; differential pair class DIFF100; rule Differential Pairs Routing [Pref Gap = 8mil    Min Gap  = 8mil    Max Gap  = 8milPref Width = 10mil    Min Width  = 10mil    Max Width  = 10mil]: RD2_N, RD2_P, TD2_N, TD2_P

### Notes on the sheet
- (in symbol CMP-00030-39455466-1) +

### Library data of the parts
C41 C42 = CMP-1659-00030-1: as C11 on sheet MCU; Case Code (Metric): 1608; Max Operating Temperature: 155 degC; RoHSCompliant: true; Case Code (Imperial): 0603; ComponentLink2Description: Datasheet; Package Quantity: 200; PackageReference: 0603; ComponentLink2URL: http://www.yageo.com/NewPortal/yageodocoutput?fileName=/pdf/MLCC/UPY-GP_NP0_16V-to-50V_14.pdf; Length: 1.6 mm; DatasheetVersion: Rev. 14, 07/2016; Min Operating Temperature: -55 degC; ComponentLink1URL: http://www.yageo.com/; Width: 0.8 mm; ComponentLink1Description: Manufacturer URL; Height: 0.45 mm; Radiation Hardening: No; PackageDescription: 2-Pin Surface Mount Device, Body 1.6 x 0.8 mm; Packaging: Tape and Reel
C43 = CMP-00030-39455466-1: as C36 on sheet Ethernet_1; Tolerance: 10%; Max Operating Temperature: 125°C; Voltage: 16V; Width: 1.6mm; Schedule B: 8532210050, 8532210050; Voltage Rating: 16V; NexarPartId: 39455466; REACH SVHC: Unknown; Length: 3.2mm; RoHS: Compliant; Case/Package: 1206; Height: 1.6mm; Termination: SMD/SMT; Depth: 1.6mm; Lead Free: Lead Free; Case Code (Imperial): 1206; Packaging: Cut Tape; Case Code (Metric): 3216; Voltage Rating (DC): 16V; Height - Seated (Max): 1.8034mm; Radiation Hardening: No; Features: General Purpose; Mount: PCB, Surface Mount; Min Operating Temperature: -55°C
C44-C47 = CMP-2008-03086-2: as C37 on sheet Ethernet_1; Automotive: No; Temperature Range High: +125°C; Octopart: https://octopart.com/c0402c104k8ractu-kemet-106349; ComponentLink2Description: Datasheet; ComponentLink2URL: https://content.kemet.com/datasheets/KEM_C1002_X7R_SMD.pdf; Temperature: -55°C to +125°C; RoHS: TRUE; Temperature Range Low: -55°C; Temperature Characteristic: X7R; Lead Free: Yes; Height: 0.55mm; Manufacturer Part Number: C0402C104K8RACTU; Voltage Rating: 10 V; Category: Cap; Device Class L3: Ceramic Capacitors; Digikey Description: CAP CER 0.1UF 10V X7R 0402; Package: C0402-BB; Device Class L1: Passive Components; Ipc Land Pattern Name: CAPC10050X50; Mouser Description: Multilayer Ceramic Capacitors MLCC - SMD/SMT 10volts 0.1uF X7R 10%; Device Class L2: Capacitors
D9-D12 = DIO-T_3.3V-8.8V-SOD923: as D5 on sheet Ethernet_1; Manufacturer Part Number: ESD3V3D9-TP; Case/Package: SOD923; Supplier-1: Digikey; Supplier Part Number-1: ESD3V3D9-TPMSCT-ND - Cut Tape (CT)
E_NET_2 = CON-SKT-RJ_8C8P-RA-TH: as E_NET_1 on sheet Ethernet_1; Case/Package: TH-CON; Supplier-1: SP ROAD; Supplier Part Number-1: A-2004-2-4-LPS-N-R
R5 = CMP-2002-00758-4: as R4 on sheet Ethernet_1; Number of Terminations: 2; Technology: THICK FILM; Packaging: Tape and Reel; RoHS Compliant: Yes; Min Operating Temperature: -55°C; Length: 1mm; Construction: Rectangular; Features: Automotive AEC-Q200; Contact Plating: Tin; Lead Free: Lead Free; Series: ERJ; Power Rating: 100mW; REACH SVHC: No SVHC; Resistor Type: Thick Film; Max Operating Temperature: 155°C; Package Quantity: 10000; Height: 0.35mm; Case/Package: 0402; Tolerance: 1%; Mount: Surface Mount; Termination: SMD/SMT; Resistance Tolerance: 1%; Depth: 0.5mm; Voltage Rating (DC): 50V; Voltage Rating: 50V; Case Code (Imperial): 0402; Military Standard: Not; Width: 0.02inch; Radiation Hardening: No; Case Code (Metric): 1005
U5 = CMP-0186-00028-2: as U? on sheet Ethernet_1; ComponentLink1URL: http://www.microchip.com/; ComponentLink2Description: Datasheet; DatasheetVersion: revC, Jan-2008; ComponentLink1Description: Manufacturer URL; PackageReference: QFN-ML28; ComponentLink3Description: Package Specification; PackageVersion: revBB, Aug-2009; ComponentLink2URL: http://ww1.microchip.com/downloads/en/DeviceDoc/39662c.pdf; ComponentLink3URL: http://www.microchip.com/stellent/groups/techpub_sg/documents/packagingspec/en012702.pdf; RevisionNote: URLs added.; Code_JEDEC: MO-220; PackageDescription: 28-Lead Plastic Quad Flat, No Lead Package (ML) - 6x6 mm Body [QFN] with 0.55 mm Contact Length
Y3 = CMP-27762-002203-1: as Y2 on sheet Ethernet_1; Load Capacitance: 18pF; Length: 5mm; Operating Frequency: 25 MHz; Number of Pins: 2; Depth: 3.2mm; Case/Package: CSMD; Packaging: Tape and Reel; Min Operating Temperature: -40°C; Width: 3.2mm; Termination: SMD/SMT; Lead Free: Lead Free; Frequency: 25MHz; Frequency Tolerance: 20ppm; ESR (Equivalent Series Resistance): 30R; Package Quantity: 1000; Max Operating Temperature: 85°C; Height: 0.051inch; Series: ABM3; REACH SVHC: Yes; Mount: Surface Mount; Resistor Type: Ceramic; Tolerance: 20ppm

## Sheet Ethernet_3.SchDoc
size A3; SheetNumber: 6; SheetTotal: 6
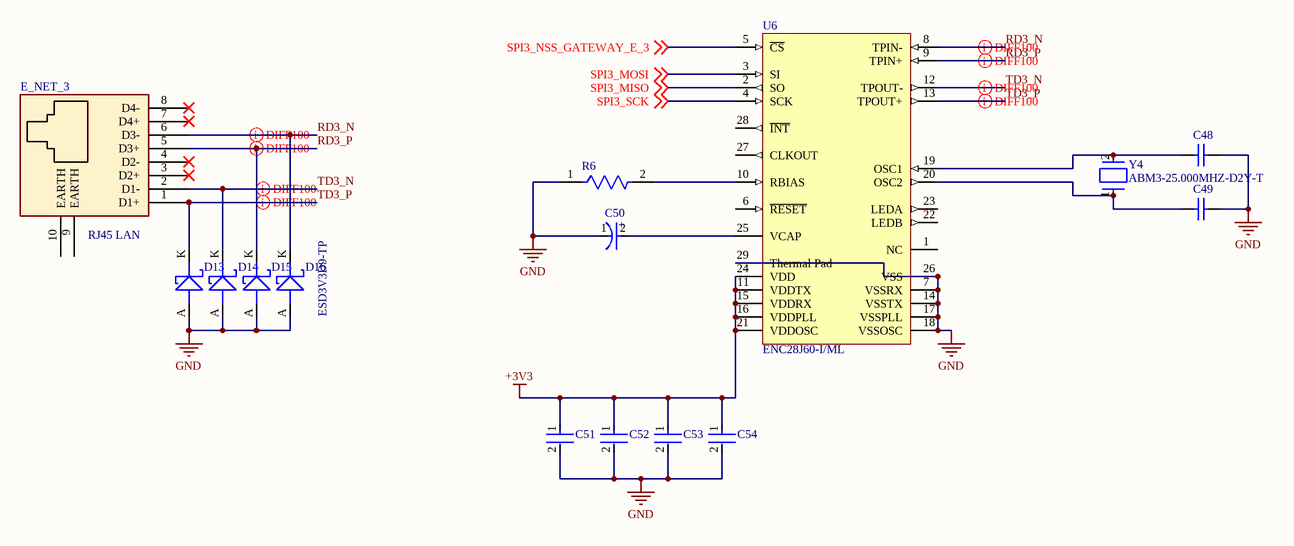
[diagram p4: Ethernet_3.SchDoc]

### Parts
C48  CC0603JRNPO9BN180  [CAPC1608X90X40LL10T20]  (value not drawn)
C49  CC0603JRNPO9BN180  [CAPC1608X90X40LL10T20]  (value not drawn)
C50  593D106X9016A2TE3  [FP-593DA-MFG]  (value not drawn)
C51  C0402C104K8RACTU  [FP-C0402-BB-MFG]  (value not drawn)
C52  C0402C104K8RACTU  [FP-C0402-BB-MFG]  (value not drawn)
C53  C0402C104K8RACTU  [FP-C0402-BB-MFG]  (value not drawn)
C54  C0402C104K8RACTU  [FP-C0402-BB-MFG]  (value not drawn)
D13  ESD3V3D9-TP  [DIO_SOD-923]  (value not drawn)
D14  ESD3V3D9-TP  [DIO_SOD-923]  (value not drawn)
D15  ESD3V3D9-TP  [DIO_SOD-923]
D16  ESD3V3D9-TP  [DIO_SOD-923]  (value not drawn)
E_NET_3  RJ45 LAN  [CON10_P106_RJ45_TH_ST]
R6  ERJ-2RKF2001X  [FP-ERJ2RK-MFG]  (value not drawn)
U6  ENC28J60-I/ML  [QFN-ML28_M]
Y4  ABM3-25.000MHZ-D2Y-T  [FP-ABM3-MFG]

### Nets
+3V3: C51.1 C52.1 C53.1 C54.1 U6.11(VDDTX) U6.15(VDDRX) U6.16(VDDPLL) U6.21(VDDOSC) U6.24(VDD)
GND: C48.1 C49.1 C50.1(C) C51.2 C52.2 C53.2 C54.2 D13.A D14.A D15.A D16.A R6.1 U6.7(VSSRX) U6.14(VSSTX) U6.17(VSSPLL) U6.18(VSSOSC) U6.26(VSS) U6.29(Thermal_Pad)
RD3_N: D16.K E_NET_3.6(D3-) U6.8(TPIN-)
RD3_P: D15.K E_NET_3.5(D3+) U6.9(TPIN+)
SPI3_MISO: U6.2(SO) ; off-sheet SPI3_MISO
SPI3_MOSI: U6.3(SI) ; off-sheet SPI3_MOSI
SPI3_NSS_GATEWAY_E_3: U6.5(~{CS}) ; off-sheet SPI3_NSS_GATEWAY_E_3
SPI3_SCK: U6.4(SCK) ; off-sheet SPI3_SCK
TD3_N: D14.K E_NET_3.2(D1-) U6.12(TPOUT-)
TD3_P: D13.K E_NET_3.1(D1+) U6.13(TPOUT+)
NetC48_2: C48.2 U6.19(OSC1) Y4.2
NetC49_2: C49.2 U6.20(OSC2) Y4.1
NetC50_2: C50.2(A) U6.25(VCAP)
NetR6_2: R6.2 U6.10(RBIAS)

Not connected (* = marked no-connect by the designer): E_NET_3 3(D2+)* 4(D2-)* 7(D4+)* 8(D4-)* 9(EARTH) 10(EARTH); U6 1(NC) 6(~{RESET}) 22(LEDB) 23(LEDA) 27(CLKOUT) 28(~{INT})

### Layout directives
differential pair; differential pair class DIFF100; rule Differential Pairs Routing [Pref Gap = 8mil    Min Gap  = 8mil    Max Gap  = 8milPref Width = 10mil    Min Width  = 10mil    Max Width  = 10mil]: RD3_N, RD3_P, TD3_N, TD3_P

### Notes on the sheet
- (in symbol CMP-00030-39455466-1) +

### Library data of the parts
C48 C49 = CMP-1659-00030-1: as C11 on sheet MCU; Case Code (Metric): 1608; Max Operating Temperature: 155 degC; RoHSCompliant: true; Case Code (Imperial): 0603; ComponentLink2Description: Datasheet; Package Quantity: 200; PackageReference: 0603; ComponentLink2URL: http://www.yageo.com/NewPortal/yageodocoutput?fileName=/pdf/MLCC/UPY-GP_NP0_16V-to-50V_14.pdf; Length: 1.6 mm; DatasheetVersion: Rev. 14, 07/2016; Min Operating Temperature: -55 degC; ComponentLink1URL: http://www.yageo.com/; Width: 0.8 mm; ComponentLink1Description: Manufacturer URL; Height: 0.45 mm; Radiation Hardening: No; PackageDescription: 2-Pin Surface Mount Device, Body 1.6 x 0.8 mm; Packaging: Tape and Reel
C50 = CMP-00030-39455466-1: as C36 on sheet Ethernet_1; Tolerance: 10%; Max Operating Temperature: 125°C; Voltage: 16V; Width: 1.6mm; Schedule B: 8532210050, 8532210050; Voltage Rating: 16V; NexarPartId: 39455466; REACH SVHC: Unknown; Length: 3.2mm; RoHS: Compliant; Case/Package: 1206; Height: 1.6mm; Termination: SMD/SMT; Depth: 1.6mm; Lead Free: Lead Free; Case Code (Imperial): 1206; Packaging: Cut Tape; Case Code (Metric): 3216; Voltage Rating (DC): 16V; Height - Seated (Max): 1.8034mm; Radiation Hardening: No; Features: General Purpose; Mount: PCB, Surface Mount; Min Operating Temperature: -55°C
C51-C54 = CMP-2008-03086-2: as C37 on sheet Ethernet_1; Automotive: No; Temperature Range High: +125°C; Octopart: https://octopart.com/c0402c104k8ractu-kemet-106349; ComponentLink2Description: Datasheet; ComponentLink2URL: https://content.kemet.com/datasheets/KEM_C1002_X7R_SMD.pdf; Temperature: -55°C to +125°C; RoHS: TRUE; Temperature Range Low: -55°C; Temperature Characteristic: X7R; Lead Free: Yes; Height: 0.55mm; Manufacturer Part Number: C0402C104K8RACTU; Voltage Rating: 10 V; Category: Cap; Device Class L3: Ceramic Capacitors; Digikey Description: CAP CER 0.1UF 10V X7R 0402; Package: C0402-BB; Device Class L1: Passive Components; Ipc Land Pattern Name: CAPC10050X50; Mouser Description: Multilayer Ceramic Capacitors MLCC - SMD/SMT 10volts 0.1uF X7R 10%; Device Class L2: Capacitors
D13-D16 = DIO-T_3.3V-8.8V-SOD923: as D5 on sheet Ethernet_1; Manufacturer Part Number: ESD3V3D9-TP; Case/Package: SOD923; Supplier-1: Digikey; Supplier Part Number-1: ESD3V3D9-TPMSCT-ND - Cut Tape (CT)
E_NET_3 = CON-SKT-RJ_8C8P-RA-TH: as E_NET_1 on sheet Ethernet_1; Case/Package: TH-CON; Supplier-1: SP ROAD; Supplier Part Number-1: A-2004-2-4-LPS-N-R
R6 = CMP-2002-00758-4: as R4 on sheet Ethernet_1; Number of Terminations: 2; Technology: THICK FILM; Packaging: Tape and Reel; RoHS Compliant: Yes; Min Operating Temperature: -55°C; Length: 1mm; Construction: Rectangular; Features: Automotive AEC-Q200; Contact Plating: Tin; Lead Free: Lead Free; Series: ERJ; Power Rating: 100mW; REACH SVHC: No SVHC; Resistor Type: Thick Film; Max Operating Temperature: 155°C; Package Quantity: 10000; Height: 0.35mm; Case/Package: 0402; Tolerance: 1%; Mount: Surface Mount; Termination: SMD/SMT; Resistance Tolerance: 1%; Depth: 0.5mm; Voltage Rating (DC): 50V; Voltage Rating: 50V; Case Code (Imperial): 0402; Military Standard: Not; Width: 0.02inch; Radiation Hardening: No; Case Code (Metric): 1005
U6 = CMP-0186-00028-2: as U? on sheet Ethernet_1; ComponentLink1URL: http://www.microchip.com/; ComponentLink2Description: Datasheet; DatasheetVersion: revC, Jan-2008; ComponentLink1Description: Manufacturer URL; PackageReference: QFN-ML28; ComponentLink3Description: Package Specification; PackageVersion: revBB, Aug-2009; ComponentLink2URL: http://ww1.microchip.com/downloads/en/DeviceDoc/39662c.pdf; ComponentLink3URL: http://www.microchip.com/stellent/groups/techpub_sg/documents/packagingspec/en012702.pdf; RevisionNote: URLs added.; Code_JEDEC: MO-220; PackageDescription: 28-Lead Plastic Quad Flat, No Lead Package (ML) - 6x6 mm Body [QFN] with 0.55 mm Contact Length
Y4 = CMP-27762-002203-1: as Y2 on sheet Ethernet_1; Load Capacitance: 18pF; Length: 5mm; Operating Frequency: 25 MHz; Number of Pins: 2; Depth: 3.2mm; Case/Package: CSMD; Packaging: Tape and Reel; Min Operating Temperature: -40°C; Width: 3.2mm; Termination: SMD/SMT; Lead Free: Lead Free; Frequency: 25MHz; Frequency Tolerance: 20ppm; ESR (Equivalent Series Resistance): 30R; Package Quantity: 1000; Max Operating Temperature: 85°C; Height: 0.051inch; Series: ABM3; REACH SVHC: Yes; Mount: Surface Mount; Resistor Type: Ceramic; Tolerance: 20ppm

## Nets that join several sheets
+3V3: power supply (7 pins), MCU (30 pins), Ethernet_1 (9 pins), Ethernet_2 (9 pins), Ethernet_3 (9 pins)
GND: power supply (14 pins), MCU (35 pins), Ethernet_1 (18 pins), Ethernet_2 (18 pins), Ethernet_3 (18 pins)
SPI2_MISO: MCU (B1.53), Ethernet_2 (U5.2)
SPI2_MOSI: MCU (B1.54), Ethernet_2 (U5.3)
SPI2_NSS_VE_2: MCU (B1.51), Ethernet_2 (U5.5)
SPI2_SCK: MCU (B1.52), Ethernet_2 (U5.4)
SPI3_MISO: MCU (B1.79), Ethernet_3 (U6.2)
SPI3_MOSI: MCU (B1.80), Ethernet_3 (U6.3)
SPI3_NSS_GATEWAY_E_3: MCU (B1.77), Ethernet_3 (U6.5)
SPI3_SCK: MCU (B1.78), Ethernet_3 (U6.4)
SPI4_MISO: MCU (B1.43), Ethernet_1 (U?.2)
SPI4_MOSI: MCU (B1.44), Ethernet_1 (U?.3)
SPI4_NSS_VE_1: MCU (B1.3), Ethernet_1 (U?.5)
SPI4_SCK: MCU (B1.1), Ethernet_1 (U?.4)